# Altium schematic sheet BigButtons.SchDoc
size Letter; Organization: Ploopy Co; Address1: 137-1140 Burnhamthorpe Road W; Address3: Ontario; DocumentNumber: 2; Revision: R1.003; SheetNumber: 2; SheetTotal: 5
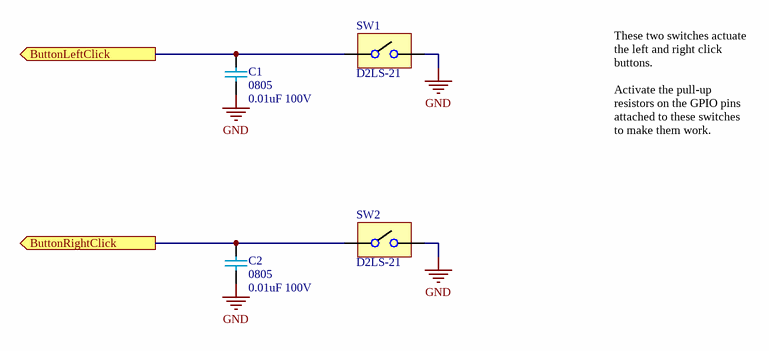
[diagram p0: BigButtons.SchDoc]

## Parts
C1  0805  value 0.01uF 100V  [0805]
C2  0805  value 0.01uF 100V  [0805]
SW1  D2LS-21  [D2LS-21]
SW2  D2LS-21  [D2LS-21]

## Ports
ButtonLeftClick (out), ButtonRightClick (out)

## Nets
GND: C1.1 C2.1 SW1.B SW2.B
ButtonLeftClick: C1.2 SW1.A ; port ButtonLeftClick
ButtonRightClick: C2.2 SW2.A ; port ButtonRightClick

## Notes on the sheet
- These two switches actuate the left and right click buttons.
  Activate the pull-up resistors on the GPIO pins attached to these switches to make them work.
- Copyright Ploopy Corporation 2019
- Licensed under the CERN OHL v. 1.2
- http://ohwr.org/cernohl
- Title:
- PCB:
- Version:
- Ploopy Corporation
- Mississauga ON L5C 0A3
- 137-1140 Burnhamthorpe Road W
- Date:
- Time:
- Sheet
- of
- Canada

## Library data of the parts
C1 C2 = Cap 0.01uF 100V: 0805, X5R or better; PNP-Nzl: 2; PNP-dx: 0; PNP-X: 2.00; PNP-Y: 1.25; PNP-Thk: 0.85; PNP-Lv: 1; PNP-TS: 70; PNP-Type: chi; PNP-FeedType: Tape; PNP-TapeWidth: 8; PNP-dy: 0; PNP-Pt: 0; PNP-W: 0; PNP-Level: 1; PNP-Voff: 0; PNP-PlacePriority: 1; PNP-A: 0; PNP-TapeIndex: 1; Supplier 1: Digi-Key; Supplier Part Number 1: 1276-6845-2-ND; Supplier 2: Arrow; Supplier Part Number 2: HFLC7Kmwq4-6R2SVzaQAUvCwxvZH1YjWdj_EBba1ByE; PNP-da: 0
SW1 SW2 = D2LS-21: Compact Surface-mounting Switch for long durability; Supplier 1: Digi-Key; Supplier 2: Mouser; Supplier Part Number 1: Z4378CT-ND; Supplier Part Number 2: 653-D2LS-21